# Altium project sram_cpu_two_windows.PrjPcb
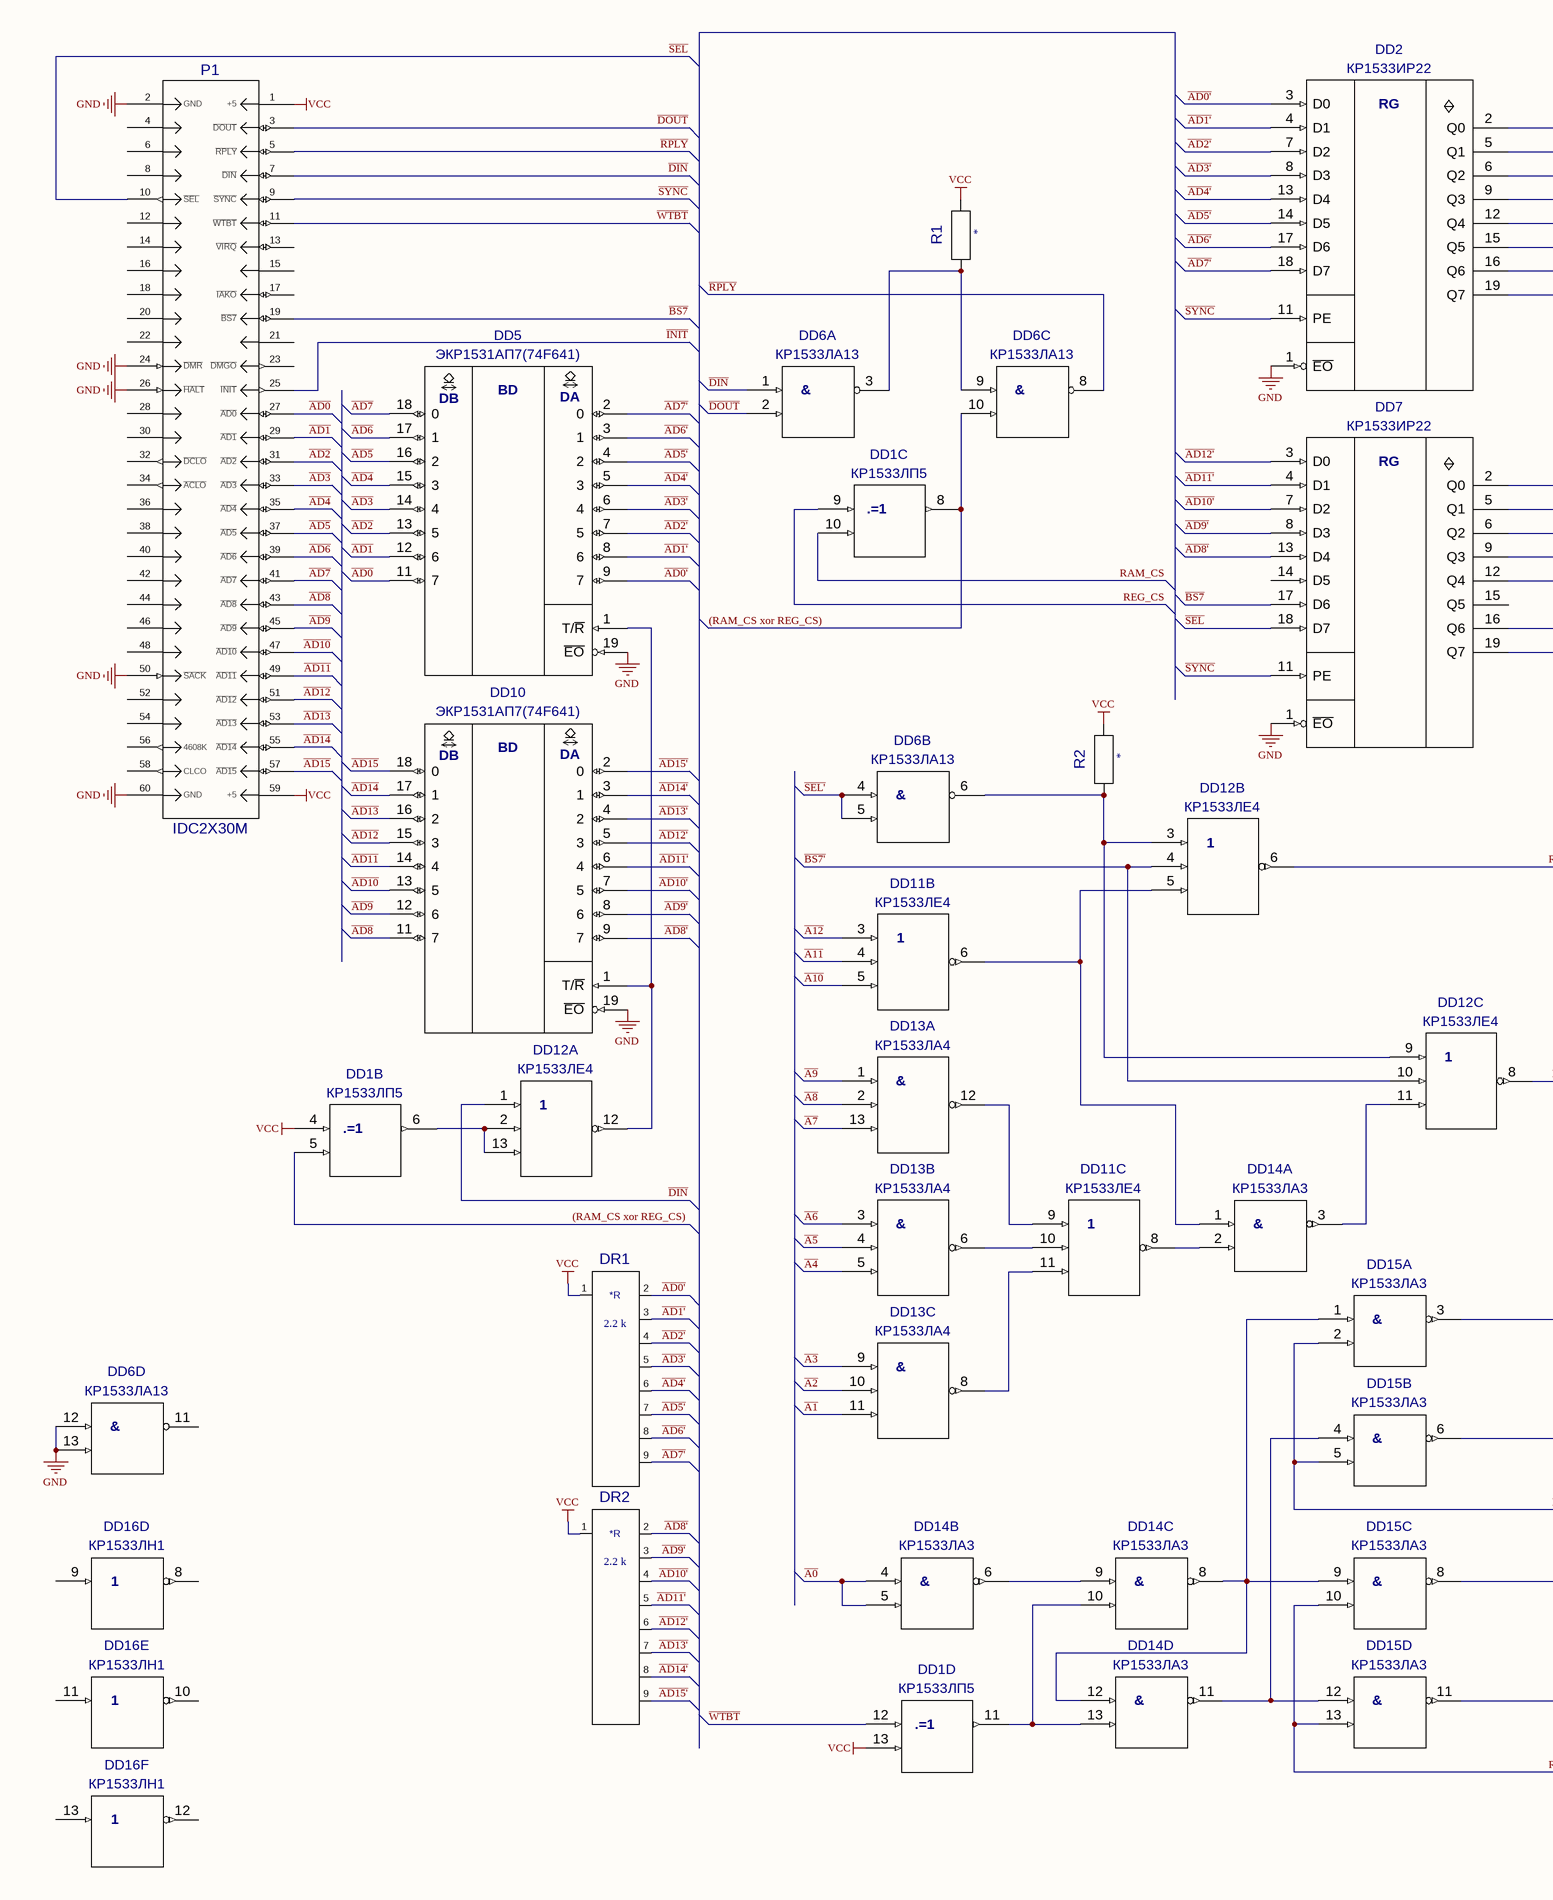
[diagram p0: sram_cpu_two_windows.SchDoc, left]
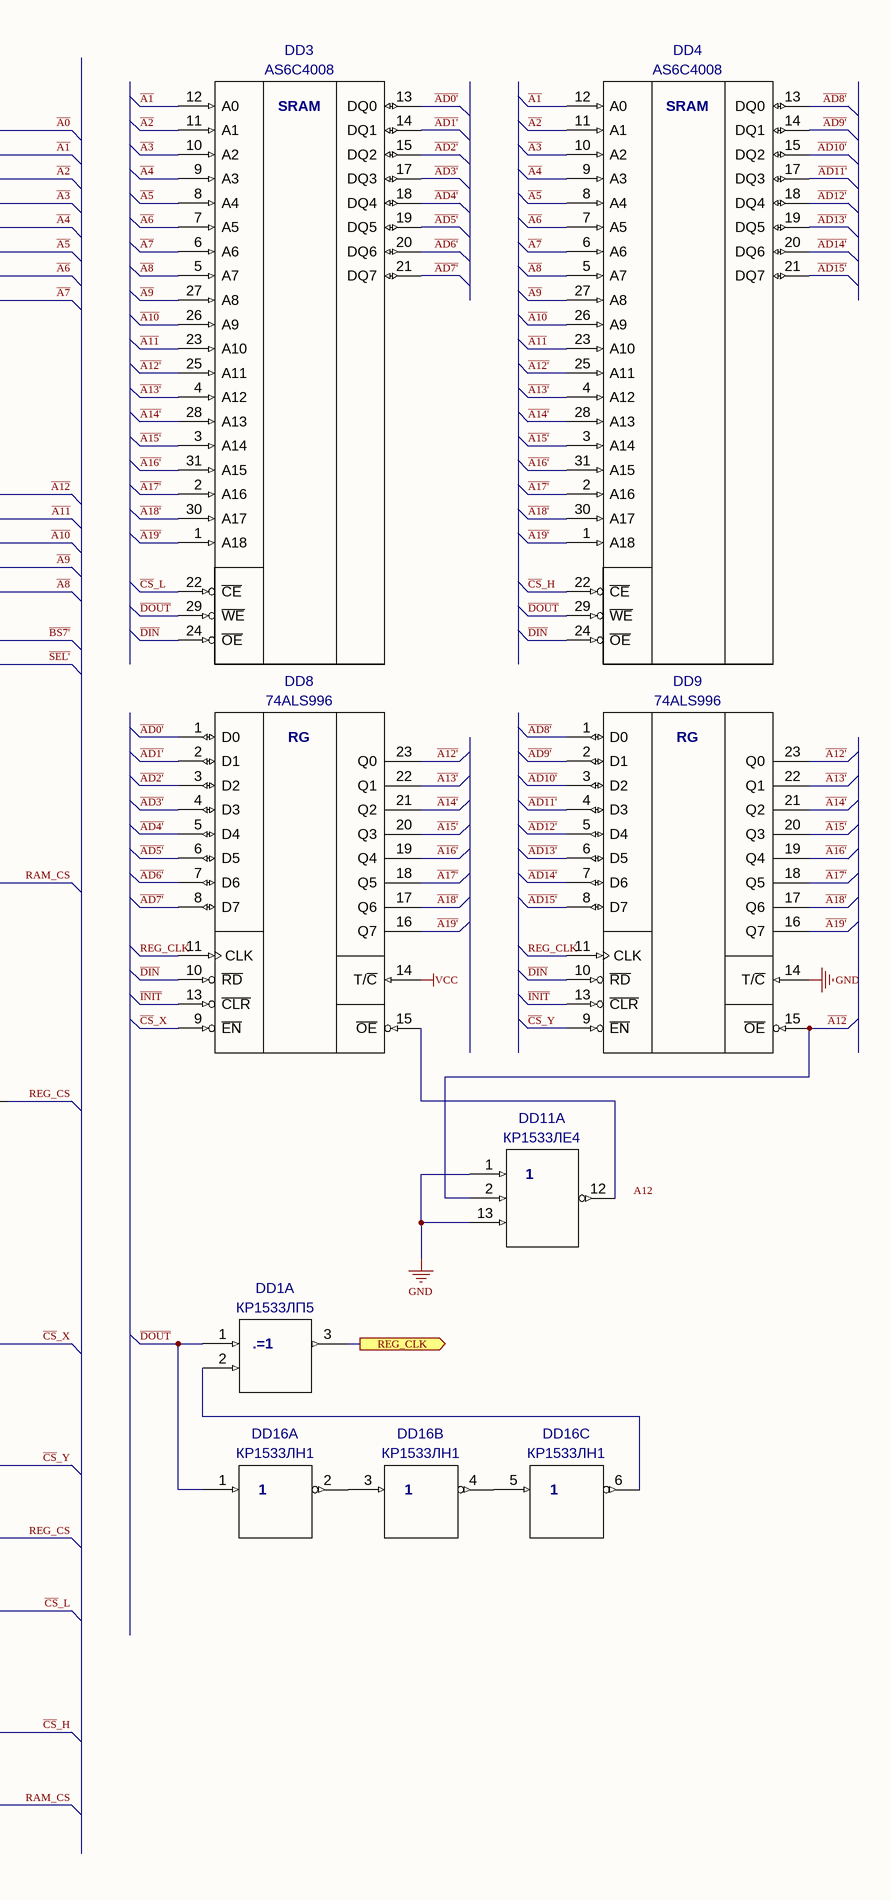
[diagram p1: sram_cpu_two_windows.SchDoc, right]
1 sheet, 21 parts. Net scope: flat (ports and power ports of the same name join across sheets).
Board file: sram_cpu_two_windows.PcbDoc

## Sheet sram_cpu_two_windows.SchDoc
size A2

### Parts
DD1  КР1533ЛП5  [2101.14-1]  (parts A,B,C,D of 4)
DD2  КР1533ИР22  [2140.20-4]
DD3  AS6C4008  [DIP32]
DD4  AS6C4008  [DIP32]
DD5  ЭКР1531АП7(74F641)  [2140.20-4]
DD6  КР1533ЛА13  [2101.14-1]  (parts A,B,C,D of 4)
DD7  КР1533ИР22  [2140.20-4]
DD8  74ALS996  [DIP24]
DD9  74ALS996  [DIP24]
DD10  ЭКР1531АП7(74F641)  [2140.20-4]
DD11  КР1533ЛЕ4  [2101.14-1]  (parts A,B,C of 3)
DD12  КР1533ЛЕ4  [2101.14-1]  (parts A,B,C of 3)
DD13  КР1533ЛА4  [2101.14-1]  (parts A,B,C of 3)
DD14  КР1533ЛА3  [2101.14-1]  (parts A,B,C,D of 4)
DD15  КР1533ЛА3  [2101.14-1]  (parts A,B,C,D of 4)
DD16  КР1533ЛН1  [2101.14-1]  (parts A,B,C,D,E,F of 6)
DR1  value 2.2 k  [NR1-4-8M]  (hidden comment: NR1-4-8M)
DR2  value 2.2 k  [NR1-4-8M]  (hidden comment: NR1-4-8M)
P1  IDC2X30M  [IDC60M]
R1  R0125A  [R0125A]  (value not drawn)
R2  R0125A  [R0125A]  (value not drawn)

### Ports
REG_CLK (out)

### Nets
GND: DD2.1(~{EO}) DD5.19(~{EO}) DD6.12 DD6.13 DD7.1(~{EO}) DD9.14(T/~{C}) DD10.19(~{EO}) DD11.1 DD11.13 P1.2(GND) P1.24(~{DMR}) P1.26(~{HALT}) P1.50(~{SACK}) P1.60(GND)
VCC: DD1.4 DD1.13 DD8.14(T/~{C}) DR1.1(I/O1) DR2.1(I/O1) P1.1(+5) P1.59(+5) R1.2(I/OB) R2.2(I/OB)
(RAM_CS xor REG_CS): DD1.5 DD1.8 DD6.10
~{A0}: DD2.2(Q0) DD14.4 DD14.5
~{A1}: DD2.5(Q1) DD3.12(A0) DD4.12(A0) DD13.11
~{A10}: DD3.26(A9) DD4.26(A9) DD7.6(Q2) DD11.5
~{A11}: DD3.23(A10) DD4.23(A10) DD7.5(Q1) DD11.4
~{A12}: DD7.2(Q0) DD9.15(~{OE}) DD11.2 DD11.3
~{A12'}: DD3.25(A11) DD4.25(A11) DD8.23(Q0) DD9.23(Q0)
~{A13'}: DD3.4(A12) DD4.4(A12) DD8.22(Q1) DD9.22(Q1)
~{A14'}: DD3.28(A13) DD4.28(A13) DD8.21(Q2) DD9.21(Q2)
~{A15'}: DD3.3(A14) DD4.3(A14) DD8.20(Q3) DD9.20(Q3)
~{A16'}: DD3.31(A15) DD4.31(A15) DD8.19(Q4) DD9.19(Q4)
~{A17'}: DD3.2(A16) DD4.2(A16) DD8.18(Q5) DD9.18(Q5)
~{A18'}: DD3.30(A17) DD4.30(A17) DD8.17(Q6) DD9.17(Q6)
~{A19'}: DD3.1(A18) DD4.1(A18) DD8.16(Q7) DD9.16(Q7)
~{A2}: DD2.6(Q2) DD3.11(A1) DD4.11(A1) DD13.10
~{A3}: DD2.9(Q3) DD3.10(A2) DD4.10(A2) DD13.9
~{A4}: DD2.12(Q4) DD3.9(A3) DD4.9(A3) DD13.5
~{A5}: DD2.15(Q5) DD3.8(A4) DD4.8(A4) DD13.4
~{A6}: DD2.16(Q6) DD3.7(A5) DD4.7(A5) DD13.3
~{A7}: DD2.19(Q7) DD3.6(A6) DD4.6(A6) DD13.13
~{A8}: DD3.5(A7) DD4.5(A7) DD7.12(Q4) DD13.2
~{A9}: DD3.27(A8) DD4.27(A8) DD7.9(Q3) DD13.1
~{AD0}: DD5.11(7) P1.27(~{AD0})
~{AD0'}: DD2.3(D0) DD3.13(DQ0) DD5.9(7) DD8.1(D0) DR1.2(I/O2)
~{AD1}: DD5.12(6) P1.29(~{AD1})
~{AD10}: DD10.13(5) P1.47(~{AD10})
~{AD10'}: DD4.15(DQ2) DD7.7(D2) DD9.3(D2) DD10.7(5) DR2.4(I/O4)
~{AD11}: DD10.14(4) P1.49(~{AD11})
~{AD11'}: DD4.17(DQ3) DD7.4(D1) DD9.4(D3) DD10.6(4) DR2.5(I/O5)
~{AD12}: DD10.15(3) P1.51(~{AD12})
~{AD12'}: DD4.18(DQ4) DD7.3(D0) DD9.5(D4) DD10.5(3) DR2.6(I/O6)
~{AD13}: DD10.16(2) P1.53(~{AD13})
~{AD13'}: DD4.19(DQ5) DD9.6(D5) DD10.4(2) DR2.7(I/O7)
~{AD14}: DD10.17(1) P1.55(~{AD14})
~{AD14'}: DD4.20(DQ6) DD9.7(D6) DD10.3(1) DR2.8(I/O8)
~{AD15}: DD10.18(0) P1.57(~{AD15})
~{AD15'}: DD4.21(DQ7) DD9.8(D7) DD10.2(0) DR2.9(I/O9)
~{AD1'}: DD2.4(D1) DD3.14(DQ1) DD5.8(6) DD8.2(D1) DR1.3(I/O3)
~{AD2}: DD5.13(5) P1.31(~{AD2})
~{AD2'}: DD2.7(D2) DD3.15(DQ2) DD5.7(5) DD8.3(D2) DR1.4(I/O4)
~{AD3}: DD5.14(4) P1.33(~{AD3})
~{AD3'}: DD2.8(D3) DD3.17(DQ3) DD5.6(4) DD8.4(D3) DR1.5(I/O5)
~{AD4}: DD5.15(3) P1.35(~{AD4})
~{AD4'}: DD2.13(D4) DD3.18(DQ4) DD5.5(3) DD8.5(D4) DR1.6(I/O6)
~{AD5}: DD5.16(2) P1.37(~{AD5})
~{AD5'}: DD2.14(D5) DD3.19(DQ5) DD5.4(2) DD8.6(D5) DR1.7(I/O7)
~{AD6}: DD5.17(1) P1.39(~{AD6})
~{AD6'}: DD2.17(D6) DD3.20(DQ6) DD5.3(1) DD8.7(D6) DR1.8(I/O8)
~{AD7}: DD5.18(0) P1.41(~{AD7})
~{AD7'}: DD2.18(D7) DD3.21(DQ7) DD5.2(0) DD8.8(D7) DR1.9(I/O9)
~{AD8}: DD10.11(7) P1.43(~{AD8})
~{AD8'}: DD4.13(DQ0) DD7.13(D4) DD9.1(D0) DD10.9(7) DR2.2(I/O2)
~{AD9}: DD10.12(6) P1.45(~{AD9})
~{AD9'}: DD4.14(DQ1) DD7.8(D3) DD9.2(D1) DD10.8(6) DR2.3(I/O3)
~{BS7}: DD7.17(D6) P1.19(~{BS7})
~{BS7'}: DD7.16(Q6) DD12.4 DD12.10
~{CS}_H: DD4.22(~{CE}) DD15.11
~{CS}_L: DD3.22(~{CE}) DD15.8
~{CS}_X: DD8.9(~{EN}) DD15.3
~{CS}_Y: DD9.9(~{EN}) DD15.6
~{DIN}: DD3.24(~{OE}) DD4.24(~{OE}) DD6.1 DD8.10(~{RD}) DD9.10(~{RD}) DD12.1 P1.7(~{DIN})
~{DOUT}: DD1.1 DD3.29(~{WE}) DD4.29(~{WE}) DD6.2 DD16.1 P1.3(~{DOUT})
~{INIT}: DD8.13(~{CLR}) DD9.13(~{CLR}) P1.25(~{INIT})
~{RPLY}: DD6.8 P1.5(~{RPLY})
RAM_CS: DD1.10 DD12.6 DD15.10 DD15.13
REG_CLK: DD8.11(CLK) DD9.11(CLK)
REG_CS: DD1.9 DD12.8 DD15.2 DD15.5
~{SEL}: DD7.18(D7) P1.10(~{SEL})
~{SEL'}: DD6.4 DD6.5 DD7.19(Q7)
~{SYNC}: DD2.11(PE) DD7.11(PE) P1.9(~{SYNC})
~{WTBT}: DD1.12 P1.11(~{WTBT})
NetDD1_2: DD1.2 DD16.6
NetDD1_3: DD1.3 ; port REG_CLK
NetDD1_6: DD1.6 DD12.2 DD12.13
NetDD1_11: DD1.11 DD14.10 DD14.13
NetDD5_1: DD5.1(T/~{R}) DD10.1(T/~{R}) DD12.12
NetDD6_3: DD6.3 DD6.9 R1.1(I/OA)
NetDD6_6: DD6.6 DD12.3 DD12.9 R2.1(I/OA)
NetDD8_15: DD8.15(~{OE}) DD11.12
NetDD11_6: DD11.6 DD12.5 DD14.1
NetDD11_8: DD11.8 DD14.2
NetDD11_9: DD11.9 DD13.12
NetDD11_10: DD11.10 DD13.6
NetDD11_11: DD11.11 DD13.8
NetDD12_11: DD12.11 DD14.3
NetDD14_6: DD14.6 DD14.9
NetDD14_8: DD14.8 DD14.12 DD15.1 DD15.9
NetDD14_11: DD14.11 DD15.4 DD15.12
NetDD16_2: DD16.2 DD16.3
NetDD16_4: DD16.4 DD16.5

Not connected (* = marked no-connect by the designer): DD1 7(GND) 14(+5V); DD2 10(GND) 20(+5V); DD3 16(Vss) 32(Vcc); DD4 16(Vss) 32(Vcc); DD5 10(GND) 20(+5V); DD6 7(GND) 11 14(+5V); DD7 10(GND) 14(D5) 15(Q5) 20(+5V); DD8 12(Vss) 24(Vcc); DD9 12(Vss) 24(Vcc); DD10 10(GND) 20(+5V); DD11 7(GND) 14(+5V); DD12 7(GND) 14(+5V); DD13 7(GND) 14(+5V); DD14 7(GND) 14(+5V); DD15 7(GND) 14(+5V); DD16 7(GND) 8 9 10 11 12 13 14(+5V); P1 4 6 8 12 13(~{VIRQ}) 14 15 16 17(~{IAKO}) 18 20 21 22 23(~{DMGO}) 28 30 32(~{DCLO}) 34(~{ACLO}) 36 38 40 42 44 46 48 52 54 56(4608K) 58(CLCO)

### Notes on the sheet
- Labels drawn without touching a wire or pin: A12
- (in symbol 74ALS996) RG
- (in symbol 74F641) BD; DB; DA
- (in symbol AS6C4008) SRAM
- (in symbol NR1-4-8M) *R
- (in symbol КР1533ИР22(74ALS373)) RG
- (in symbol КР1533ЛА3(74ALS00), part A) &
- (in symbol КР1533ЛА3(74ALS00), part B) &
- (in symbol КР1533ЛА3(74ALS00), part C) &
- (in symbol КР1533ЛА3(74ALS00), part D) &
- (in symbol КР1533ЛА4(74ALS10), part A) &
- (in symbol КР1533ЛА4(74ALS10), part B) &
- (in symbol КР1533ЛА4(74ALS10), part C) &
- (in symbol КР1533ЛА13(74ALS38), part A) &
- (in symbol КР1533ЛА13(74ALS38), part B) &
- (in symbol КР1533ЛА13(74ALS38), part C) &
- (in symbol КР1533ЛА13(74ALS38), part D) &
- (in symbol КР1533ЛП5(74ALS86), part A) .=1
- (in symbol КР1533ЛП5(74ALS86), part B) .=1
- (in symbol КР1533ЛП5(74ALS86), part C) .=1
- (in symbol КР1533ЛП5(74ALS86), part D) .=1

### Library data of the parts
DD1 = КР1533ЛП5(74ALS86): Value: *
DD2 DD7 = КР1533ИР22(74ALS373): Value: *
DD5 DD10 = 74F641: Value: *
DD6 = КР1533ЛА13(74ALS38): Value: *
DD11 DD12 = КР1533ЛЕ4(74ALS27): Value: *
DD13 = КР1533ЛА4(74ALS10): Value: *
DD14 DD15 = КР1533ЛА3(74ALS00): Value: *
DD16 = КР1533ЛН1(74ALS04): Value: *
P1 = IDC2X30M_A: IDC Header; Value: *
R1 R2 = R0125A: PDIF_TY: 11107; Value: *
DD3 DD4 = AS6C4008: Value: *
DD8 DD9 = 74ALS996: Value: *